# Altium schematic sheet AMS_supply.SchDoc: Supply Circuit
size A4; CheckedBy: Àlex Sánchez i Benet; DrawnBy: Àlex Sánchez i Benet; DocumentNumber: 1; Revision: 1; SheetNumber: 3; SheetTotal: 4; University: UPC EEBE; City: Barcelona; Country: Spain; CP: 08019; Address: Av. Eduard Maristany, 16
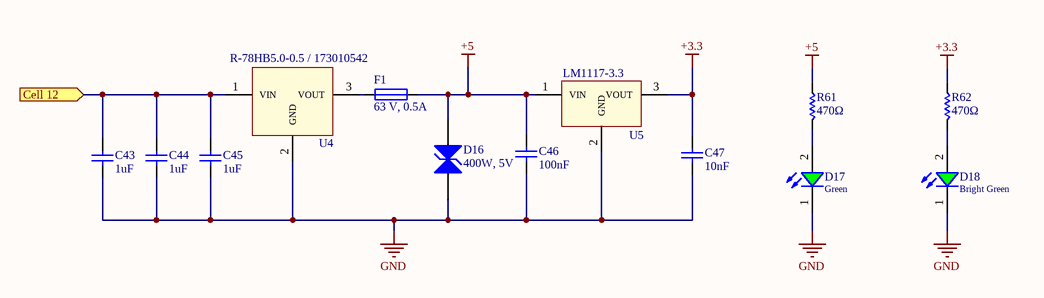
[diagram p0: AMS_supply.SchDoc]

## Parts
C43  1uF  [0805_2x1.25x1.25mm_Reflow Soldering]
C44  1uF  [0805_2x1.25x1.25mm_Reflow Soldering]
C45  1uF  [0805_2x1.25x1.25mm_Reflow Soldering]
C46  100nF  [0805_2x1.25x0.8mm_Reflow Soldering]
C47  10nF  [0805_2x1.25x0.8mm_Reflow Soldering]
D16  400W, 5V  [WE-TVSP_DO-214AC_Bidirectional]
D17  Green  [WL-SMCW_0805]
D18  Bright Green  [WL-SMCW_0805]
F1  63 V, 0.5A  [437 Series]
R61  470Ω  [CR0805]
R62  470Ω  [CR0805]
U4  R-78HB5.0-0.5 / 173010542  [R-78HB5.0-0.5]  (value not drawn)
U5  Reference: LM1117-3.3  [LM1117IMP3.3]  (hidden comment: 1.5 - 13.8 Vin, 3.3 Vout)

## Ports
Cell 12 (in)

## Nets
+3.3: C47.2 R62.2 U5.3(VOUT)
+5: C46.2 D16.2(C) F1.2 R61.2 U5.1(VIN)
GND: C43.1 C44.1 C45.1 C46.1 C47.1 D16.1(C) D17.1(K) D18.1(K) U4.2(GND) U5.2(GND)
Cell 12: C43.2 C44.2 C45.2 U4.1(VIN) ; port Cell 12
NetD17_2: D17.2(A) R61.1
NetD18_2: D18.2(A) R62.1
NetF1_1: F1.1 U4.3(VOUT)

## Notes on the sheet
- R-78HB5.0-0.5 / 173010542
- Title
- e-Tech Racing
- UPC EEBE
- Size:
- Date:
- Drawn by:
- A4
- Number:
- Time:
- Revision:
- Sheet
- of
- Av. Eduard Maristany, 16
- 08019
- Barcelona Spain
- Made with:
- Checked by:

## Library data of the parts
C43-C45 = 885012207103: WCAP-CSGP Ceramic Capacitors, 0805, X7R, 50V, 1uF; Rated Voltage: 50V DC; ComponentLink1Description: Manufacturer; ComponentLink1URL: http://www.we-online.de; ComponentLink2Description: Datasheet; ComponentLink2URL: http://katalog.we-online.de/pbs/datasheet/885012207103.pdf; Part Number: 885012207103; Publisher: Wurth Elektronik; Size: 0805; Operating Temperature: -55 °C to +125 °C; Value: 1uF; Ceramic Type: X7R
C46 = 885012207098: WCAP-CSGP Ceramic Capacitors, 0805, X7R, 50V, 100nF; Rated Voltage: 50V DC; ComponentLink1Description: Manufacturer; ComponentLink1URL: http://www.we-online.de; ComponentLink2Description: Datasheet; ComponentLink2URL: http://katalog.we-online.de/pbs/datasheet/885012207098.pdf; Part Number: 885012207098; Publisher: Wurth Elektronik; Size: 0805; Operating Temperature: -55 °C to +125 °C; Value: 100nF; Ceramic Type: X7R
C47 = 885012207092: WCAP-CSGP Ceramic Capacitors, 0805, X7R, 50V, 10nF; Rated Voltage: 50V DC; ComponentLink1Description: Manufacturer; ComponentLink1URL: http://www.we-online.de; ComponentLink2Description: Datasheet; ComponentLink2URL: http://katalog.we-online.de/pbs/datasheet/885012207092.pdf; Part Number: 885012207092; Publisher: Wurth Elektronik; Size: 0805; Operating Temperature: -55 °C to +125 °C; Value: 10nF; Ceramic Type: X7R
D16 = 824501500: WE-TVSP Power TVS Diode, size DO-214AC, Bidirectional, 400 W, 5 VDC; Manufacturer: Wurth Elektronik; Peak Pulse Current: 43.5 A; Reverse Breakdown Voltage: 6.7 V; Surge Clamping Voltage: 9.2 V; ComponentLink1Description: Manufacturer; ComponentLink1URL: http://www.we-online.de; ComponentLink2Description: Datasheet; ComponentLink2URL: https://katalog.we-online.de/pbs/datasheet/824501500.pdf; Part Number: 824501500; Size: DO-214AC; Operating Temperature: -65ºC to 150 ºC; Mounting Technology: SMT; Packaging: Tape and Reel; Polarity: Bidirectional; Power Dissipation: 400 W; Reverse Stand-Off Voltage: 5 V
D17 = 150080GS75000: SMT Mono-color Chip LED Waterclear WL-SMCW, size 0805, Green, 3.2 V, 140 deg, 450 mcd; Forward Voltage: 3.2 V; Viewing Angle: 140 deg; Peak Wavelength: 515 nm; Dominant Wavelength: 525 nm; Luminous Intensity: 450 mcd; Chip Technology: InGaN; ComponentLink1Description: Manufacturer; ComponentLink1URL: http://www.we-online.de; ComponentLink2Description: Datasheet; ComponentLink2URL: https://katalog.we-online.de/led/datasheet/150080GS75000.pdf; Part Number: 150080GS75000; Published Date: November 2018; Publisher: Wurth Elektronik; Size: 0805; Operating Temperature: -40 to 85 degC; Emitting Color: Green; Mounting Technology: SMT; Packaging: Tape and Reel
D18 = 150080VS75000: SMT Mono-color Chip LED Waterclear WL-SMCW, size 0805, Bright Green, 2 V, 140 deg, 40 mcd; Forward Voltage: 2 V; Viewing Angle: 140 deg; Peak Wavelength: 572 nm; Dominant Wavelength: 570 nm; Luminous Intensity: 40 mcd; Chip Technology: AlInGaP; ComponentLink1Description: Manufacturer; ComponentLink1URL: http://www.we-online.de; ComponentLink2Description: Datasheet; ComponentLink2URL: https://katalog.we-online.de/led/datasheet/150080VS75000.pdf; Part Number: 150080VS75000; Published Date: November 2018; Publisher: Wurth Elektronik; Size: 0805; Operating Temperature: -40 to 85 degC; Emitting Color: Bright Green; Mounting Technology: SMT; Packaging: Tape and Reel
F1 = 0437.500A: 437A Series Fuse; Manufacturer: Littlefuse; ComponentLink1Description: Datasheet; ComponentLink1URL: https://www.littelfuse.com/~/media/electronics/datasheets/fuses/littelfuse_fuse_437a_datasheet.pdf.pdf
R61 R62 = CR0805-FX-4700GLF: Chip Resistor 0805; Manufacturer: Bourns; ComponentLink1Description: Datasheet; ComponentLink1URL: https://www.bourns.com/docs/product-datasheets/chpreztr.pdf?sfvrsn=566c91f1_11
U4 = R-78HB5.0-0.5: High efficiency, high input voltage switching regulator.; ComponentLink1Description: Datasheet R-78HB5.0-0.5; ComponentLink1URL: https://www.recom-power.com/pdf/Innoline/R-78HBxx-0.5_L.pdf; ComponentLink2Description: Datasheet 173010542; ComponentLink2URL: https://katalog.we-online.de/pm/datasheet/173010542.pdf
U5 = LM1117IMP-3.3/NOPB: 800-mA Low-Dropout Linear Regulator; Manufacturer: Texas Instruments; Output Voltage: 3.3 V; Output Current: 800 mA; Input Voltage: 1.5-13.8 V; ComponentLink1Description: Datasheet; ComponentLink1URL: http://www.ti.com/lit/ds/symlink/lm1117.pdf